# Altium schematic sheet FPGA SDRAM bank.SchDoc
size A3
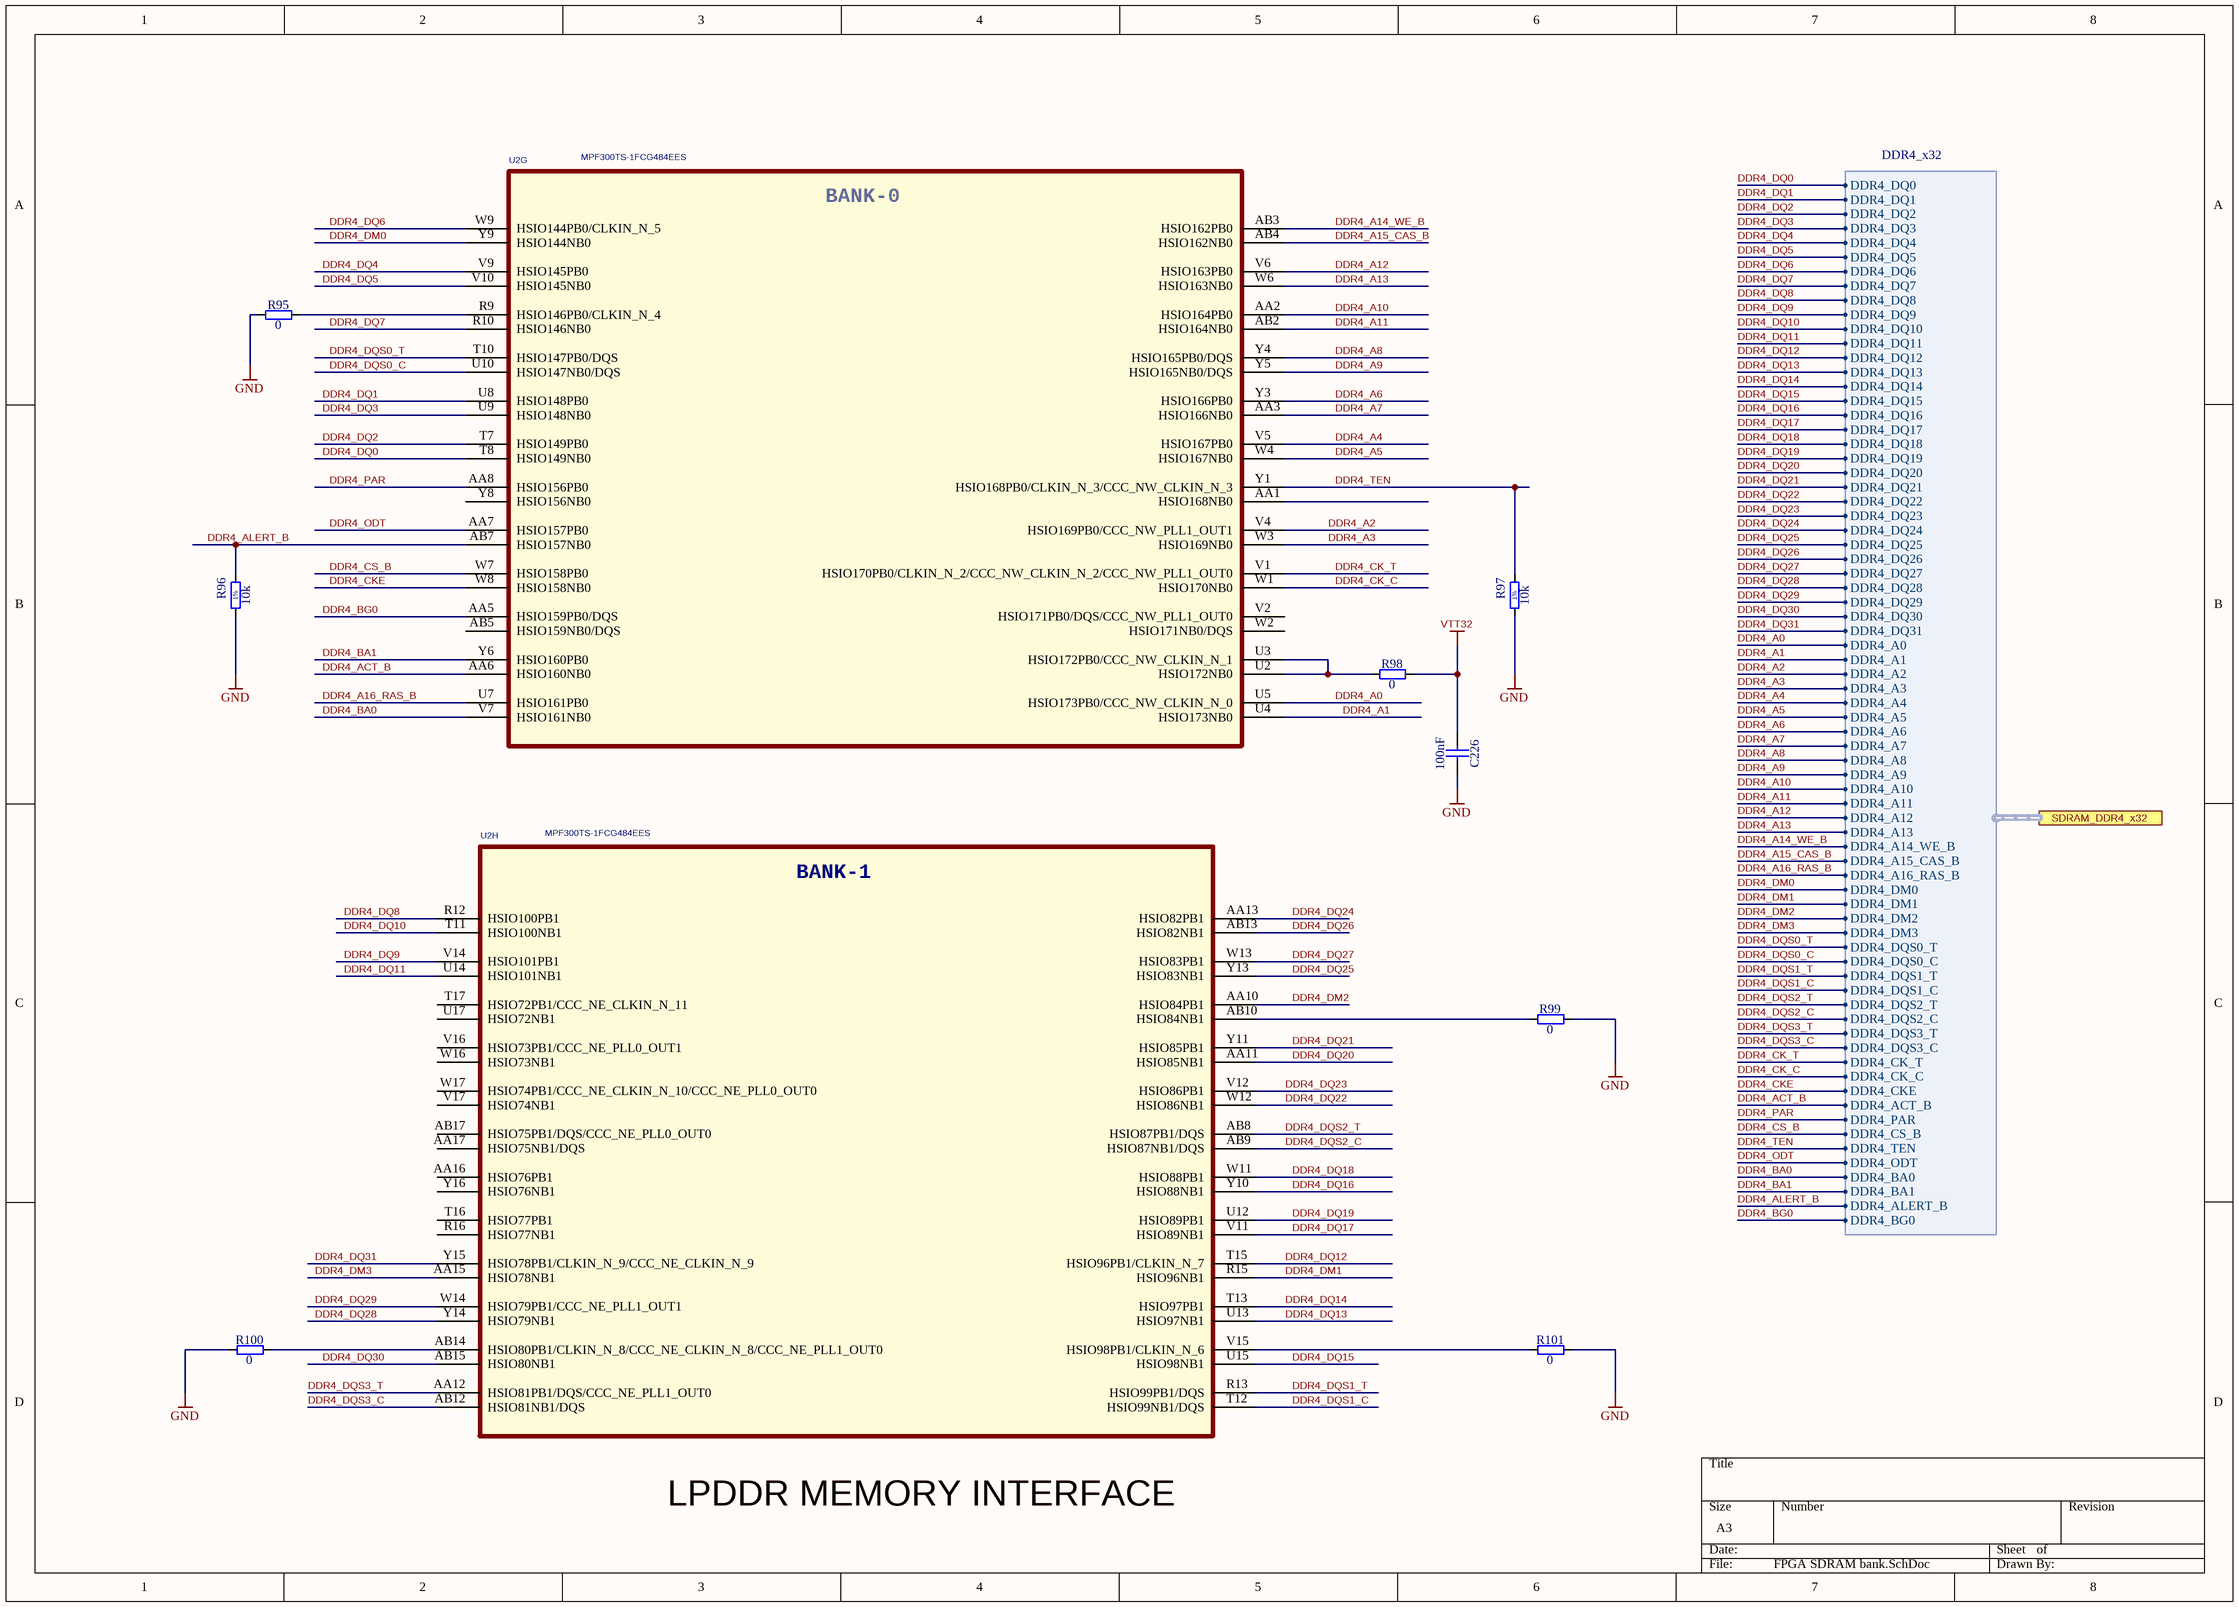
[diagram p0: FPGA SDRAM bank.SchDoc]

## Parts
C226  100nF  [CAPC0603X33N]
R95  0  [RESC1005X40N]
R96  10k  [RESC1005X40N]
R97  10k  [RESC1005X40N]
R98  0  [RESC1005X40N]
R99  0  [RESC1005X40N]
R100  0  [RESC1005X40N]
R101  0  [RESC1005X40N]
U2  MPF300TS-1FCG484EES  [BGA484C100P22X22_2300X2300X320]  (parts G,H of 11)

## Ports
SDRAM_DDR4_x32 (harness DDR4_x32)

## Harnesses
DDR4_x32: DDR4_DQ16, DDR4_DQ17, DDR4_DQ18, DDR4_DQ19, DDR4_DQ20, DDR4_DQ21, DDR4_DQ22, DDR4_DQ23, DDR4_DQ24, DDR4_DQ25, DDR4_DQ26, DDR4_DQ27, DDR4_DQ28, DDR4_DQ29, DDR4_DQ30, DDR4_DQ31, DDR4_A0, DDR4_A1, DDR4_A2, DDR4_A3, DDR4_A4, DDR4_A5, DDR4_A6, DDR4_A7, DDR4_A8, DDR4_A9, DDR4_A10, DDR4_A11, DDR4_A12, DDR4_A13, DDR4_A14_WE_B, DDR4_A15_CAS_B, DDR4_A16_RAS_B, DDR4_DM0, DDR4_DM1, DDR4_DM2, DDR4_DM3, DDR4_DQS0_T, DDR4_DQS0_C, DDR4_DQS1_T, DDR4_DQS1_C, DDR4_DQS2_T, DDR4_DQS2_C, DDR4_DQS3_T, DDR4_DQS3_C, DDR4_CK_T, DDR4_CK_C, DDR4_CKE, DDR4_ACT_B, DDR4_PAR, DDR4_CS_B, DDR4_TEN, DDR4_ODT, DDR4_BA0, DDR4_BA1, DDR4_ALERT_B, DDR4_BG0, DDR4_DQ0, DDR4_DQ1, DDR4_DQ2, DDR4_DQ3, DDR4_DQ4, DDR4_DQ5, DDR4_DQ6, DDR4_DQ7, DDR4_DQ8, DDR4_DQ9, DDR4_DQ10, DDR4_DQ11, DDR4_DQ12, DDR4_DQ13, DDR4_DQ14, DDR4_DQ15

## Nets
GND: C226.2 R95.1 R96.1 R97.1 R99.2 R100.1 R101.2
VTT32: C226.1 R98.2
DDR4_A0: U2.U5(HSIO173PB0/CCC_NW_CLKIN_N_0) ; port SDRAM_DDR4_x32.DDR4_A0
DDR4_A1: U2.U4(HSIO173NB0) ; port SDRAM_DDR4_x32.DDR4_A1
DDR4_A2: U2.V4(HSIO169PB0/CCC_NW_PLL1_OUT1) ; port SDRAM_DDR4_x32.DDR4_A2
DDR4_A3: U2.W3(HSIO169NB0) ; port SDRAM_DDR4_x32.DDR4_A3
DDR4_A4: U2.V5(HSIO167PB0) ; port SDRAM_DDR4_x32.DDR4_A4
DDR4_A5: U2.W4(HSIO167NB0) ; port SDRAM_DDR4_x32.DDR4_A5
DDR4_A6: U2.Y3(HSIO166PB0) ; port SDRAM_DDR4_x32.DDR4_A6
DDR4_A7: U2.AA3(HSIO166NB0) ; port SDRAM_DDR4_x32.DDR4_A7
DDR4_A8: U2.Y4(HSIO165PB0/DQS) ; port SDRAM_DDR4_x32.DDR4_A8
DDR4_A9: U2.Y5(HSIO165NB0/DQS) ; port SDRAM_DDR4_x32.DDR4_A9
DDR4_A10: U2.AA2(HSIO164PB0) ; port SDRAM_DDR4_x32.DDR4_A10
DDR4_A11: U2.AB2(HSIO164NB0) ; port SDRAM_DDR4_x32.DDR4_A11
DDR4_A12: U2.V6(HSIO163PB0) ; port SDRAM_DDR4_x32.DDR4_A12
DDR4_A13: U2.W6(HSIO163NB0) ; port SDRAM_DDR4_x32.DDR4_A13
DDR4_A14_WE_B: U2.AB3(HSIO162PB0) ; port SDRAM_DDR4_x32.DDR4_A14_WE_B
DDR4_A15_CAS_B: U2.AB4(HSIO162NB0) ; port SDRAM_DDR4_x32.DDR4_A15_CAS_B
DDR4_A16_RAS_B: U2.U7(HSIO161PB0) ; port SDRAM_DDR4_x32.DDR4_A16_RAS_B
DDR4_ACT_B: U2.AA6(HSIO160NB0) ; port SDRAM_DDR4_x32.DDR4_ACT_B
DDR4_ALERT_B: R96.2 U2.AB7(HSIO157NB0) ; port SDRAM_DDR4_x32.DDR4_ALERT_B
DDR4_BA0: U2.V7(HSIO161NB0) ; port SDRAM_DDR4_x32.DDR4_BA0
DDR4_BA1: U2.Y6(HSIO160PB0) ; port SDRAM_DDR4_x32.DDR4_BA1
DDR4_BG0: U2.AA5(HSIO159PB0/DQS) ; port SDRAM_DDR4_x32.DDR4_BG0
DDR4_CK_C: U2.W1(HSIO170NB0) ; port SDRAM_DDR4_x32.DDR4_CK_C
DDR4_CK_T: U2.V1(HSIO170PB0/CLKIN_N_2/CCC_NW_CLKIN_N_2/CCC_NW_PLL1_OUT0) ; port SDRAM_DDR4_x32.DDR4_CK_T
DDR4_CKE: U2.W8(HSIO158NB0) ; port SDRAM_DDR4_x32.DDR4_CKE
DDR4_CS_B: U2.W7(HSIO158PB0) ; port SDRAM_DDR4_x32.DDR4_CS_B
DDR4_DM0: U2.Y9(HSIO144NB0) ; port SDRAM_DDR4_x32.DDR4_DM0
DDR4_DM1: U2.R15(HSIO96NB1) ; port SDRAM_DDR4_x32.DDR4_DM1
DDR4_DM2: U2.AA10(HSIO84PB1) ; port SDRAM_DDR4_x32.DDR4_DM2
DDR4_DM3: U2.AA15(HSIO78NB1) ; port SDRAM_DDR4_x32.DDR4_DM3
DDR4_DQ0: U2.T8(HSIO149NB0) ; port SDRAM_DDR4_x32.DDR4_DQ0
DDR4_DQ1: U2.U8(HSIO148PB0) ; port SDRAM_DDR4_x32.DDR4_DQ1
DDR4_DQ2: U2.T7(HSIO149PB0) ; port SDRAM_DDR4_x32.DDR4_DQ2
DDR4_DQ3: U2.U9(HSIO148NB0) ; port SDRAM_DDR4_x32.DDR4_DQ3
DDR4_DQ4: U2.V9(HSIO145PB0) ; port SDRAM_DDR4_x32.DDR4_DQ4
DDR4_DQ5: U2.V10(HSIO145NB0) ; port SDRAM_DDR4_x32.DDR4_DQ5
DDR4_DQ6: U2.W9(HSIO144PB0/CLKIN_N_5) ; port SDRAM_DDR4_x32.DDR4_DQ6
DDR4_DQ7: U2.R10(HSIO146NB0) ; port SDRAM_DDR4_x32.DDR4_DQ7
DDR4_DQ8: U2.R12(HSIO100PB1) ; port SDRAM_DDR4_x32.DDR4_DQ8
DDR4_DQ9: U2.V14(HSIO101PB1) ; port SDRAM_DDR4_x32.DDR4_DQ9
DDR4_DQ10: U2.T11(HSIO100NB1) ; port SDRAM_DDR4_x32.DDR4_DQ10
DDR4_DQ11: U2.U14(HSIO101NB1) ; port SDRAM_DDR4_x32.DDR4_DQ11
DDR4_DQ12: U2.T15(HSIO96PB1/CLKIN_N_7) ; port SDRAM_DDR4_x32.DDR4_DQ12
DDR4_DQ13: U2.U13(HSIO97NB1) ; port SDRAM_DDR4_x32.DDR4_DQ13
DDR4_DQ14: U2.T13(HSIO97PB1) ; port SDRAM_DDR4_x32.DDR4_DQ14
DDR4_DQ15: U2.U15(HSIO98NB1) ; port SDRAM_DDR4_x32.DDR4_DQ15
DDR4_DQ16: U2.Y10(HSIO88NB1) ; port SDRAM_DDR4_x32.DDR4_DQ16
DDR4_DQ17: U2.V11(HSIO89NB1) ; port SDRAM_DDR4_x32.DDR4_DQ17
DDR4_DQ18: U2.W11(HSIO88PB1) ; port SDRAM_DDR4_x32.DDR4_DQ18
DDR4_DQ19: U2.U12(HSIO89PB1) ; port SDRAM_DDR4_x32.DDR4_DQ19
DDR4_DQ20: U2.AA11(HSIO85NB1) ; port SDRAM_DDR4_x32.DDR4_DQ20
DDR4_DQ21: U2.Y11(HSIO85PB1) ; port SDRAM_DDR4_x32.DDR4_DQ21
DDR4_DQ22: U2.W12(HSIO86NB1) ; port SDRAM_DDR4_x32.DDR4_DQ22
DDR4_DQ23: U2.V12(HSIO86PB1) ; port SDRAM_DDR4_x32.DDR4_DQ23
DDR4_DQ24: U2.AA13(HSIO82PB1) ; port SDRAM_DDR4_x32.DDR4_DQ24
DDR4_DQ25: U2.Y13(HSIO83NB1) ; port SDRAM_DDR4_x32.DDR4_DQ25
DDR4_DQ26: U2.AB13(HSIO82NB1) ; port SDRAM_DDR4_x32.DDR4_DQ26
DDR4_DQ27: U2.W13(HSIO83PB1) ; port SDRAM_DDR4_x32.DDR4_DQ27
DDR4_DQ28: U2.Y14(HSIO79NB1) ; port SDRAM_DDR4_x32.DDR4_DQ28
DDR4_DQ29: U2.W14(HSIO79PB1/CCC_NE_PLL1_OUT1) ; port SDRAM_DDR4_x32.DDR4_DQ29
DDR4_DQ30: U2.AB15(HSIO80NB1) ; port SDRAM_DDR4_x32.DDR4_DQ30
DDR4_DQ31: U2.Y15(HSIO78PB1/CLKIN_N_9/CCC_NE_CLKIN_N_9) ; port SDRAM_DDR4_x32.DDR4_DQ31
DDR4_DQS0_C: U2.U10(HSIO147NB0/DQS) ; port SDRAM_DDR4_x32.DDR4_DQS0_C
DDR4_DQS0_T: U2.T10(HSIO147PB0/DQS) ; port SDRAM_DDR4_x32.DDR4_DQS0_T
DDR4_DQS1_C: U2.T12(HSIO99NB1/DQS) ; port SDRAM_DDR4_x32.DDR4_DQS1_C
DDR4_DQS1_T: U2.R13(HSIO99PB1/DQS) ; port SDRAM_DDR4_x32.DDR4_DQS1_T
DDR4_DQS2_C: U2.AB9(HSIO87NB1/DQS) ; port SDRAM_DDR4_x32.DDR4_DQS2_C
DDR4_DQS2_T: U2.AB8(HSIO87PB1/DQS) ; port SDRAM_DDR4_x32.DDR4_DQS2_T
DDR4_DQS3_C: U2.AB12(HSIO81NB1/DQS) ; port SDRAM_DDR4_x32.DDR4_DQS3_C
DDR4_DQS3_T: U2.AA12(HSIO81PB1/DQS/CCC_NE_PLL1_OUT0) ; port SDRAM_DDR4_x32.DDR4_DQS3_T
DDR4_ODT: U2.AA7(HSIO157PB0) ; port SDRAM_DDR4_x32.DDR4_ODT
DDR4_PAR: U2.AA8(HSIO156PB0) ; port SDRAM_DDR4_x32.DDR4_PAR
DDR4_TEN: R97.2 U2.Y1(HSIO168PB0/CLKIN_N_3/CCC_NW_CLKIN_N_3) ; port SDRAM_DDR4_x32.DDR4_TEN
NetR95_2: R95.2 U2.R9(HSIO146PB0/CLKIN_N_4)
NetR98_1: R98.1 U2.U2(HSIO172NB0) U2.U3(HSIO172PB0/CCC_NW_CLKIN_N_1)
NetR99_1: R99.1 U2.AB10(HSIO84NB1)
NetR100_2: R100.2 U2.AB14(HSIO80PB1/CLKIN_N_8/CCC_NE_CLKIN_N_8/CCC_NE_PLL1_OUT0)
NetR101_1: R101.1 U2.V15(HSIO98PB1/CLKIN_N_6)

Not connected (* = marked no-connect by the designer): U2 AA1(HSIO168NB0) AA16(HSIO76PB1) AA17(HSIO75NB1/DQS) AB5(HSIO159NB0/DQS) AB17(HSIO75PB1/DQS/CCC_NE_PLL0_OUT0) R16(HSIO77NB1) T16(HSIO77PB1) T17(HSIO72PB1/CCC_NE_CLKIN_N_11) U17(HSIO72NB1) V2(HSIO171PB0/DQS/CCC_NW_PLL1_OUT0) V16(HSIO73PB1/CCC_NE_PLL0_OUT1) V17(HSIO74NB1) W2(HSIO171NB0/DQS) W16(HSIO73NB1) W17(HSIO74PB1/CCC_NE_CLKIN_N_10/CCC_NE_PLL0_OUT0) Y8(HSIO156NB0) Y16(HSIO76NB1)

## Notes on the sheet
- LPDDR MEMORY INTERFACE
- (in symbol FPGA_MPF300T-FCG484, part G) BANK-0
- (in symbol FPGA_MPF300T-FCG484, part H) BANK-1
- (in symbol R0402_10K_1%_0.0625W_100PPM) 1%

## Library data of the parts
C226 = CC0201_100NF_6.3V_10%_X5R: Non-polarised capacitor; Manufacturer: GENERIC; Part Description: SMD Multilayer Chip Ceramic Capacitor; Manufacturer1 Part Number: 02016D104KAT2A; Tolerance: ±10%; Voltage: 6.3V; TC: X5R; Manufacturer Part Number: CC0201_100NF_6.3V_10%_X5R; Part Number: CC0201_100NF_6.3V_10%_X5R; Value: 100nF; Component Kind: Standard; Component Type: Standard; Pin Count: 2; Status: Not Recommended; Case: 0201; Mounted: Yes; Socket: No; SMD: Yes; Sense: No; Manufacturer1 Example: AVX; Manufacturer1 ComponentHeight: 0.33mm; HelpURL: \\cern.ch\dfs\Applications\Altium\Datasheets\CC0201_X5R_AVX.pdf; Author: CERN DEM JLC; CreateDate: 03/12/2007; LatestRevisionDate: 03/12/2007
R95 R98-R101 = R0402_0R_JUMPER: Resistor; Part Description: 1A (0.05R Max DC Resistance) Zero Ohm Jumper; Manufacturer: GENERIC; Manufacturer1 Part Number: 232270591001L; PressFit: No; Part Number: R0402_0R_JUMPER; Component Kind: Standard; Component Type: Standard; Pin Count: 2; Value: 0; Status: Not Recommended; Manufacturer Part Number: R0402_0R_JUMPER; Case: 0402; Mounted: Yes; Sense: No; Socket: No; SMD: Yes; Manufacturer1 Example: YAGEO PHYCOMP; Manufacturer1 ComponentHeight: 0.4mm; HelpURL: \\cern.ch\dfs\Applications\Altium\Datasheets\R0402_Phycomp_RC0402.pdf; Author: CERN DEM JLC; CreateDate: 03/12/2007; LatestRevisionDate: 17/10/2012
R96 R97 = R0402_10K_1%_0.0625W_100PPM: Resistor - 1%; Manufacturer: GENERIC; Part Description: General Purpose Thick Film Chip Resistor; Manufacturer1 Part Number: 232270671003L; TC: ±100ppm/°C; PressFit: No; Manufacturer Part Number: R0402_10K_1%_0.0625W_100PPM; Part Number: R0402_10K_1%_0.0625W_100PPM; Tolerance: ±1%; Value: 10k; Component Kind: Standard; Component Type: Standard; Pin Count: 2; Status: Not Recommended; Power: 0.0625W; Case: 0402; Mounted: Yes; Sense: No; Socket: No; SMD: Yes; Manufacturer1 Example: YAGEO PHYCOMP; Manufacturer1 ComponentHeight: 0.4mm; HelpURL: \\cern.ch\dfs\Applications\Altium\Datasheets\R0402_Phycomp_RC0402.pdf; Author: CERN DEM JLC; CreateDate: 03/12/2007; LatestRevisionDate: 17/10/2012
U2 = FPGA_MPF300T-FCG484: FCG484,23mmX23mm,1.0mm pitch; Manufacturer: Microsemi; Part Number: MPF300TS-1FCG484I